# Altium schematic sheet BTB_CONN.SchDoc: =project_title
size Tabloid; CompanyName: Luxonis Holding; Organization: Luxonis Holding; Address1: 1925 Harmony Park Drive; Address2: Westminster, CO; Address3: 80234; Address4: United States; SheetNumber: 3; SheetTotal: 8
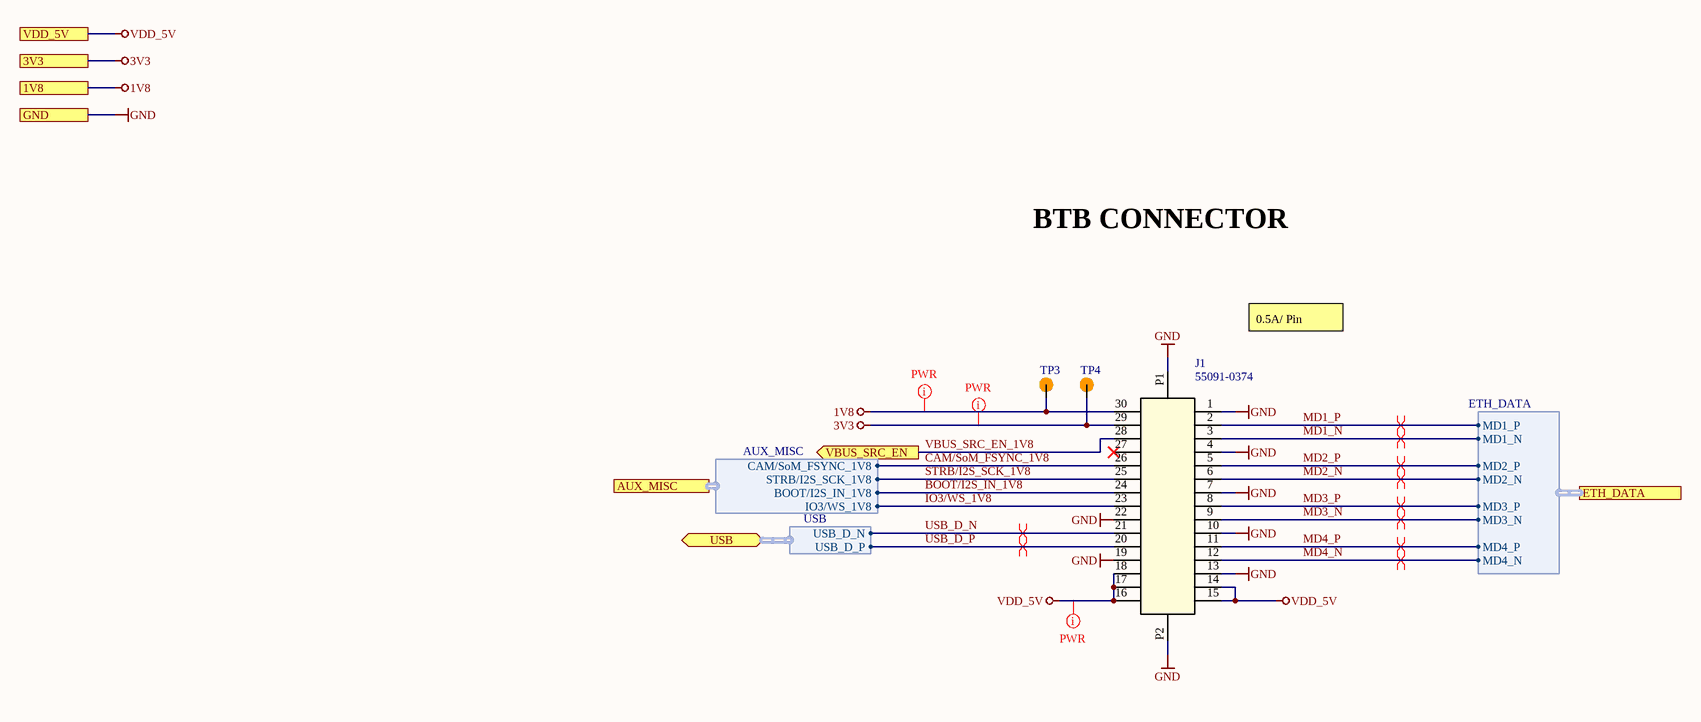
[diagram p0: BTB_CONN.SchDoc]

## Parts
J1  55091-0374  [CON_550910374]
TP3  TP100_200_NS  [TP075_150_NS]  (value not drawn)  (no BOM)
TP4  TP100_200_NS  [TP075_150_NS]  (value not drawn)  (no BOM)

## Ports
1V8, 3V3, AUX_MISC (harness AUX_MISC), ETH_DATA (harness ETH_DATA), GND, USB (bidir, harness USB), VBUS_SRC_EN (out), VDD_5V

## Harnesses
ETH_DATA: MD1_P, MD1_N, MD2_P, MD2_N, MD3_P, MD3_N, MD4_P, MD4_N
USB: USB_D_P, USB_D_N
AUX_MISC: CAM/SoM_FSYNC_1V8, STRB/I2S_SCK_1V8, BOOT/I2S_IN_1V8, IO3/WS_1V8

## Nets
1V8: J1.30 TP3.1 ; port 1V8
3V3: J1.29 TP4.1 ; port 3V3
GND: J1.1 J1.4 J1.7 J1.10 J1.13 J1.19 J1.22 J1.P1 J1.P2 ; port GND
VDD_5V: J1.14 J1.15 J1.16 J1.17 J1.18 ; port VDD_5V
BOOT/I2S_IN_1V8: J1.24 ; port AUX_MISC.BOOT/I2S_IN_1V8
CAM/SoM_FSYNC_1V8: J1.26 ; port AUX_MISC.CAM/SoM_FSYNC_1V8
IO3/WS_1V8: J1.23 ; port AUX_MISC.IO3/WS_1V8
MD1_N: J1.3 ; port ETH_DATA.MD1_N
MD1_P: J1.2 ; port ETH_DATA.MD1_P
MD2_N: J1.6 ; port ETH_DATA.MD2_N
MD2_P: J1.5 ; port ETH_DATA.MD2_P
MD3_N: J1.9 ; port ETH_DATA.MD3_N
MD3_P: J1.8 ; port ETH_DATA.MD3_P
MD4_N: J1.12 ; port ETH_DATA.MD4_N
MD4_P: J1.11 ; port ETH_DATA.MD4_P
STRB/I2S_SCK_1V8: J1.25 ; port AUX_MISC.STRB/I2S_SCK_1V8
USB_D_N: J1.21 ; port USB.USB_D_N
USB_D_P: J1.20 ; port USB.USB_D_P
VBUS_SRC_EN_1V8: J1.28 ; port VBUS_SRC_EN

Not connected (* = marked no-connect by the designer): J1 27*

## Layout directives
differential pair; net class USB2; differential pair class 90ohm: USB_D_N, USB_D_P
differential pair; net class ETH; differential pair class 100ohm: MD1_N, MD1_P, MD2_N, MD2_P, MD3_N, MD3_P, MD4_N, MD4_P
net class PWR; Current Rating: 3A: VDD_5V
net class PWR; Current Rating: 100mA: 1V8, 3V3

## Notes on the sheet
- BTB CONNECTOR
- 0.5A/ Pin
- Title
- Size:
- Date:
- Tabloid
- Number:
- Time:
- Revision:
- Sheet
- of
- Drawn by:

## Library data of the parts
J1 = CMP-00021-4: CONN, Board-to-Board Connector, Mezzanine, 0.635mm pitch, 2x15, 30 positions, Receptacle, Mated height 12mm; Manufacturer 1: Molex; Max Current Rating: 500mA; Voltage Rating: 100V; Manufacturer Part Number 1: 55091-0374; Max Operating Temperature: 105°C; Connector Type: Mezzanine; Gender: Receptacle; Min Operating Temperature: -55°C; Pins: 30; System: Connector
TP3 TP4 = CMP-015-000000-2: Manufacturer Part Number 1: /; Source: LuxonisMaster.SchLib; Design Item ID: TEST_POINT